# EAGLE design radio-v3.2 (EAGLE 9.6.1)
REVISION: 3.0; SCH_DESC: Dual ISM43340 5GHz radio transciever.; TEAM: RoboCup SSL
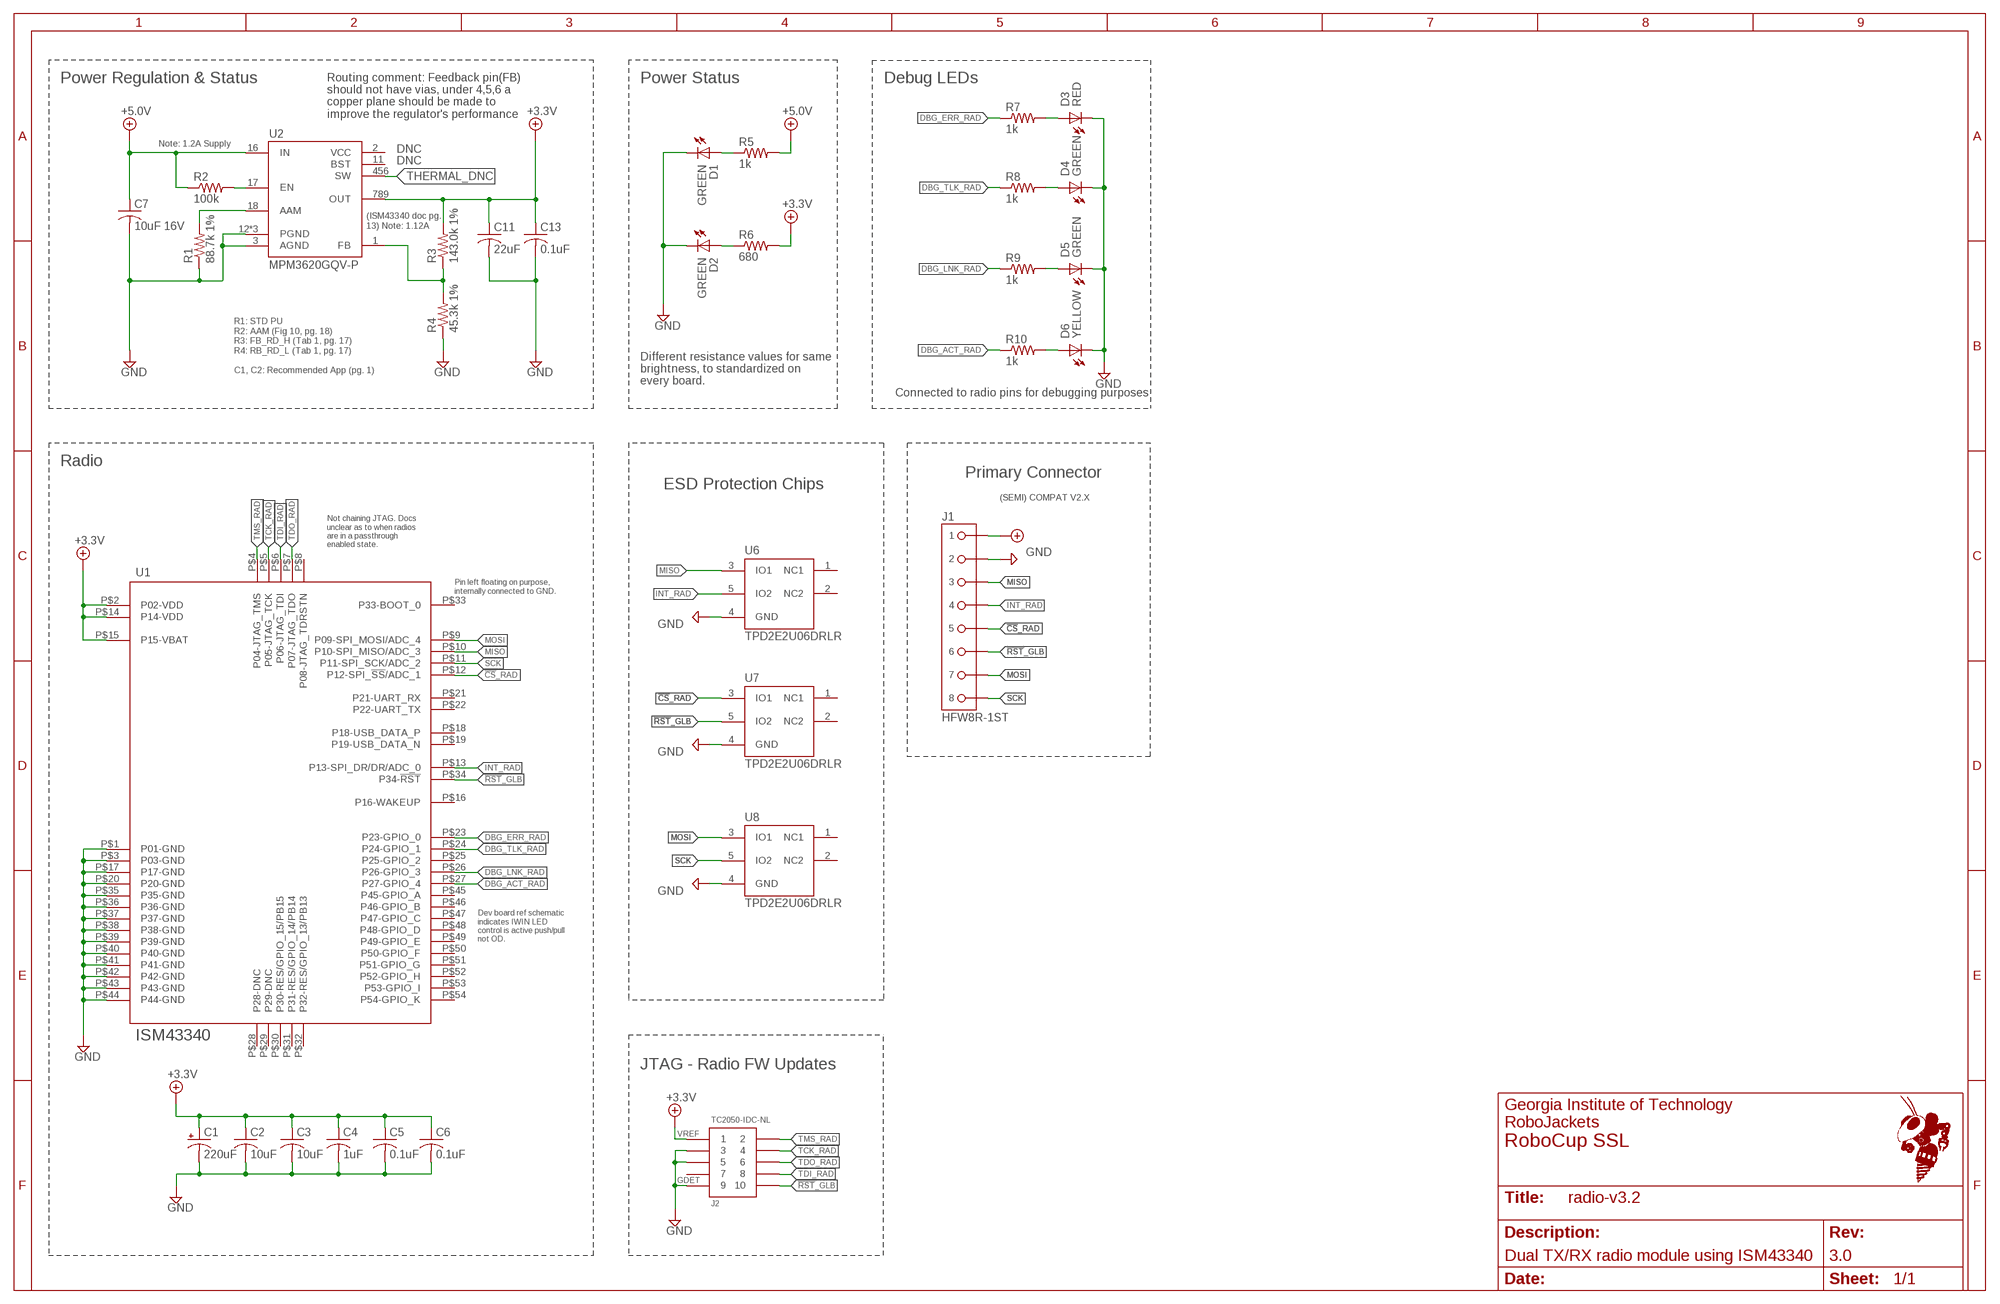
[diagram p0: schematic, sheet 1]
FRAME1 (FRAME_B_L): SCH_DESC: Dual TX/RX radio module using ISM43340

## Parts
C1  220uF  ECA-0JM221  [ECA-0JM221-HGT_HORIZ]
C2  10uF  C-USC0805  [C0805]
C3  10uF  C-USC0805  [C0805]
C4  1uF  C-USC0603  [C0603]
C5  0.1uF  C-USC0603  [C0603]
C6  0.1uF  C-USC0603  [C0603]
C7  10uF 16V  C-USC1210  [C1210]
C11  22uF  C-USC1210  [C1210]
C13  0.1uF  C-USC0603  [C0603]
D1  GREEN  LED-SMD-GREEN  [CHIP-LED0603]
D2  GREEN  LED-SMD-GREEN  [CHIP-LED0603]
D3  RED  LED-SMD-RED  [CHIP-LED0603]
D4  GREEN  LED-SMD-GREEN  [CHIP-LED0603]
D5  GREEN  LED-SMD-GREEN  [CHIP-LED0603]
D6  YELLOW  LED-SMD-YELLOW  [CHIP-LED0603]
J1  HFW8R-1ST  [HFW8R-1ST]
J2  TC2050-IDC-NL  [TC2050-IDC-NL]
R1  88.7k 1%  R-US_R0603  [R0603]
R2  100k  R-US_R0603  [R0603]
R3  143.0k 1%  R-US_R0603  [R0603]
R4  45.3k 1%  R-US_R0603  [R0603]
R5  1k  R-US_R0603  [R0603]
R6  680  R-US_R0603  [R0603]
R7  1k  R-US_R0603  [R0603]
R8  1k  R-US_R0603  [R0603]
R9  1k  R-US_R0603  [R0603]
R10  1k  R-US_R0603  [R0603]
U1  ISM43340  [ISM43340]
U2  MPM3620GQV-P  [MPM3620GQV-P]
U6  TPD2E2U06DRLR  [SOT-553]
U7  TPD2E2U06DRLR  [SOT-553]
U8  TPD2E2U06DRLR  [SOT-553]

## Nets
3V3_PWR_IND: D2.A R6.1
5V_PWR_IND: D1.A R5.1
!CS!_RAD: J1.5 U1.P$12(P12-SPI_!SS!/ADC_1) U7.3(IO1)
!RST!_GLB: J1.6 J2.P$10 U1.P$34(P34-!RST!) U7.5(IO2)
+3.3V: C1.P$1(+) C2.1 C3.1 C4.1 C5.1 C6.1 C11.1 C13.1 J2.P$1 R3.2 R6.2 U1.P$2(P02-VDD) U1.P$14(P14-VDD) U1.P$15(P15-VBAT) U2.789(OUT)
+5.0V: C7.1 J1.1 R2.1 R5.2 U2.16(IN)
AAM: R1.2 U2.18(AAM)
DBG_ACT_RAD: R10.1 U1.P$27(P27-GPIO_4)
DBG_ERR: D3.A R7.2
DBG_ERR_RAD: R7.1 U1.P$23(P23-GPIO_0)
DBG_LNK_RAD: R9.1 U1.P$26(P26-GPIO_3)
DBG_TLK_RAD: R8.1 U1.P$24(P24-GPIO_1)
DGB_ACT: D6.A R10.2
DGB_LNK: D5.A R9.2
EN: R2.2 U2.17(EN)
FB: R3.1 R4.2 U2.1(FB)
GND: C1.P$2(-) C2.2 C3.2 C4.2 C5.2 C6.2 C7.2 C11.2 C13.2 D1.C(K) D2.C(K) D3.C(K) D4.C(K) D5.C(K) D6.C(K) J1.2 J2.P$3 J2.P$5 J2.P$9 R1.1 R4.1 U1.P$1(P01-GND) U1.P$3(P03-GND) U1.P$17(P17-GND) U1.P$20(P20-GND) U1.P$35(P35-GND) U1.P$36(P36-GND) U1.P$37(P37-GND) U1.P$38(P38-GND) U1.P$39(P39-GND) U1.P$40(P40-GND) U1.P$41(P41-GND) U1.P$42(P42-GND) U1.P$43(P43-GND) U1.P$44(P44-GND) U2.3(AGND) U2.12(PGND) U2.13(PGND) U2.14(PGND) U6.4(GND) U7.4(GND) U8.4(GND)
INT_RAD: J1.4 U1.P$13(P13-SPI_DR/DR/ADC_0) U6.5(IO2)
MISO: J1.3 U1.P$10(P10-SPI_MISO/ADC_3) U6.3(IO1)
MOSI: J1.7 U1.P$9(P09-SPI_MOSI/ADC_4) U8.3(IO1)
SCK: J1.8 U1.P$11(P11-SPI_SCK/ADC_2) U8.5(IO2)
TCK_RAD: J2.P$4 U1.P$5(P05-JTAG_TCK)
TDI_RAD: J2.P$8 U1.P$6(P06-JTAG_TDI)
TDO_RAD: J2.P$6 U1.P$7(P07-JTAG_TDO)
THERMAL_DNC: U2.456(SW)
TLK: D4.A R8.2
TMS_RAD: J2.P$2 U1.P$4(P04-JTAG_TMS)
Unconnected: J1.LEG1 J1.LEG2 J2.P$7 U1.P$8(P08-JTAG_TDRSTN) U1.P$16(P16-WAKEUP) U1.P$18(P18-USB_DATA_P) U1.P$19(P19-USB_DATA_N) U1.P$21(P21-UART_RX) U1.P$22(P22-UART_TX) U1.P$25(P25-GPIO_2) U1.P$28(P28-DNC) U1.P$29(P29-DNC) U1.P$30(P30-RES/GPIO_15/PB15) U1.P$31(P31-RES/GPIO_14/PB14) U1.P$32(P32-RES/GPIO_13/PB13) U1.P$33(P33-BOOT_0) U1.P$45(P45-GPIO_A) U1.P$46(P46-GPIO_B) U1.P$47(P47-GPIO_C) U1.P$48(P48-GPIO_D) U1.P$49(P49-GPIO_E) U1.P$50(P50-GPIO_F) U1.P$51(P51-GPIO_G) U1.P$52(P52-GPIO_H) U1.P$53(P53-GPIO_I) U1.P$54(P54-GPIO_K) U2.2(VCC) U2.11(BST) U6.1(NC1) U6.2(NC2) U7.1(NC1) U7.2(NC2) U8.1(NC1) U8.2(NC2)

## Notes on the sheet
- Power Regulation & Status | Power Status | Debug LEDs
- Routing comment: Feedback pin(FB)
  should not have vias, under 4,5,6 a 
  copper plane should be made to 
  improve the regulator's performance
- Note: 1.2A Supply
- DNC
- DNC
- (ISM43340 doc pg. 
  13) Note: 1.12A
- R1: STD PU
  R2: AAM (Fig 10, pg. 18)
  R3: FB_RD_H (Tab 1, pg. 17)
  R4: RB_RD_L (Tab 1, pg. 17)
  
  C1, C2: Recommended App (pg. 1)
- Different resistance values for same
  brightness, to standardized on 
  every board.
- Connected to radio pins for debugging purposes
- Radio
- Primary Connector
- ESD Protection Chips
- (SEMI) COMPAT V2.X
- Not chaining JTAG. Docs 
  unclear as to when radios 
  are in a passthrough 
  enabled state.
- Pin left floating on purpose, 
  internally connected to GND.
- Dev board ref schematic 
  indicates IWIN LED 
  control is active push/pull 
  not OD.
- JTAG - Radio FW Updates
- VREF
- GDET

## Library data of the parts
C1 = RoboJackets-Capacitors:ECA-0JM221; DIGIKEY: P5572-ND; MANUFACTURER_PART_NUMBER: ECA-1HHG221
C2-C7 C11 C13 = rcl:C-US: CAPACITOR, American symbol; SPICEPREFIX: C
D1 D2 D4 D5 = RoboJackets-LEDs:LED-SMD; DIGIKEY: 160-1446-1-ND; MPN: LTST-C191KGKT
D3 = RoboJackets-LEDs:LED-SMD; DIGIKEY: 160-1447-1-ND; MPN: LTST-C191KRKT
D6 = RoboJackets-LEDs:LED-SMD; DIGIKEY: 160-1448-1-ND; MPN: LTST-C191KSKT
J1 = RoboJackets-Connectors:HFW8; DIGIKEY: 609-1788-1-ND; MPN: HFW8R-1STE1LF
J2 = RoboJackets-Connectors:TC2050-IDC-NL
R1-R10 = rcl:R-US_: RESISTOR, American symbol; SPICEPREFIX: R
U1 = RoboJackets-RF:ISM43340
U2 = mchair:MPM3620GQV-P
U6-U8 = radio_in_progress:TPD2E2U06DRLR

## Board
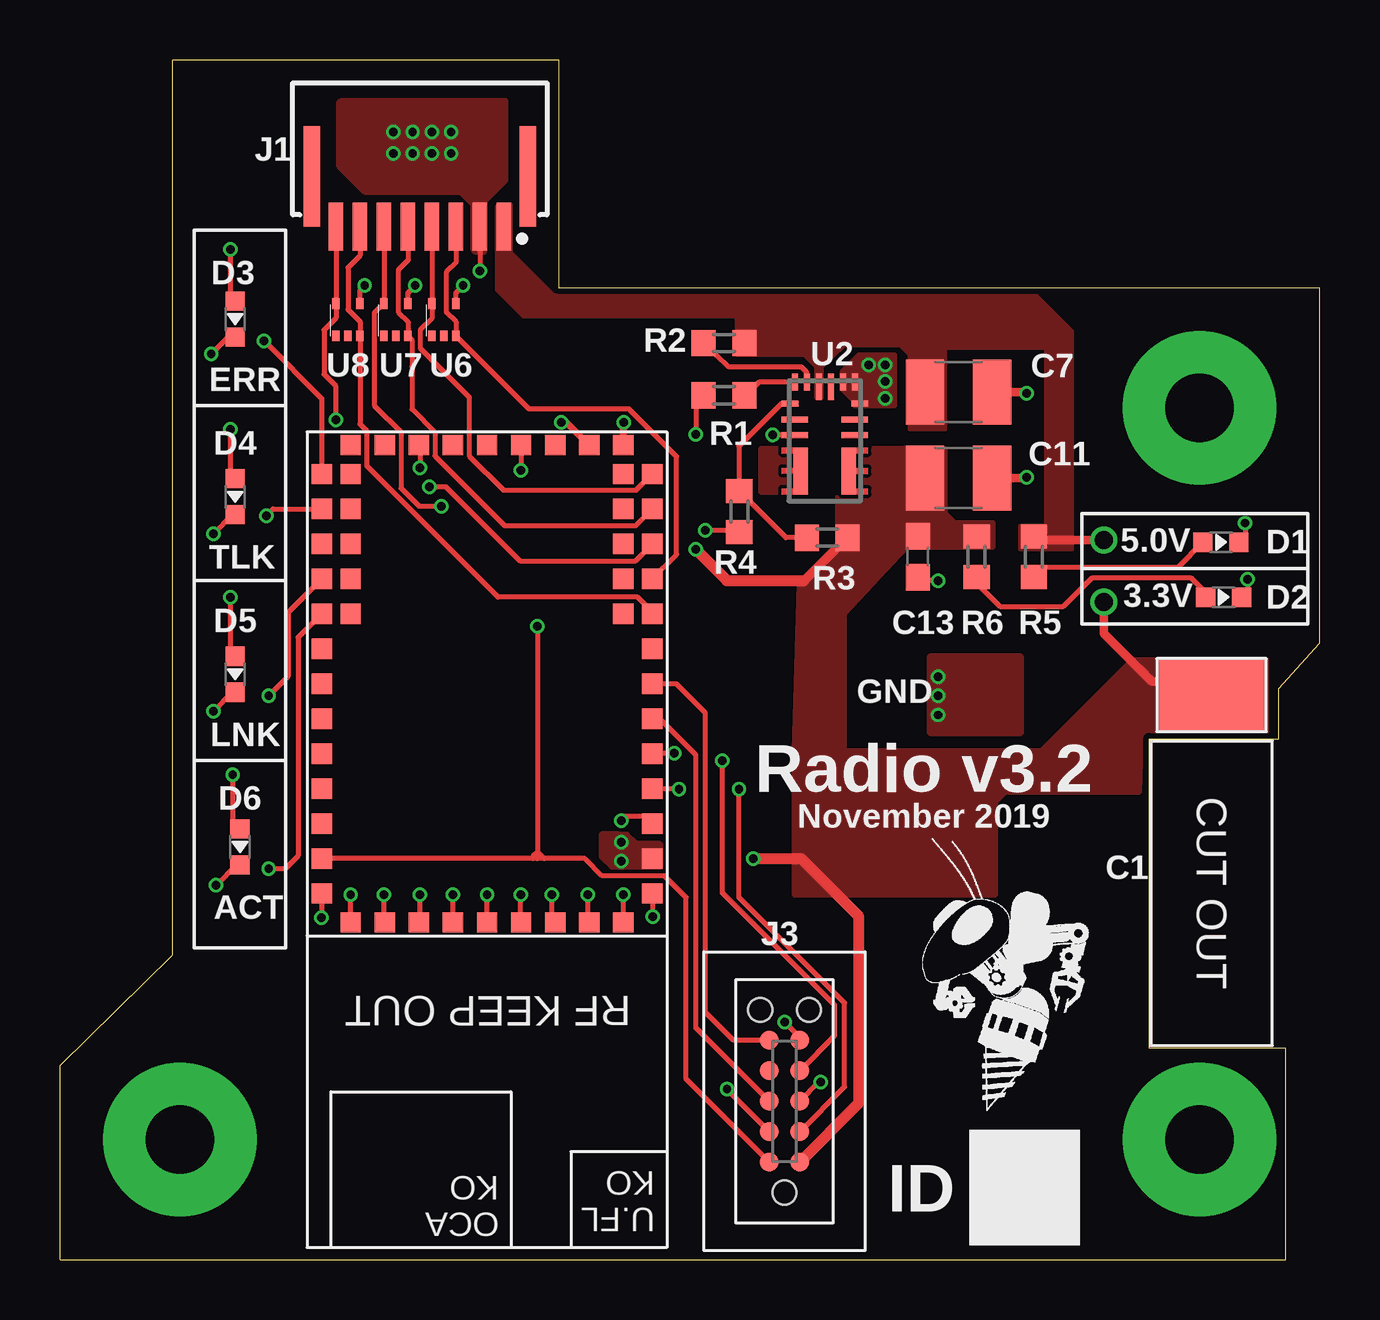
[diagram p1: board, top side]
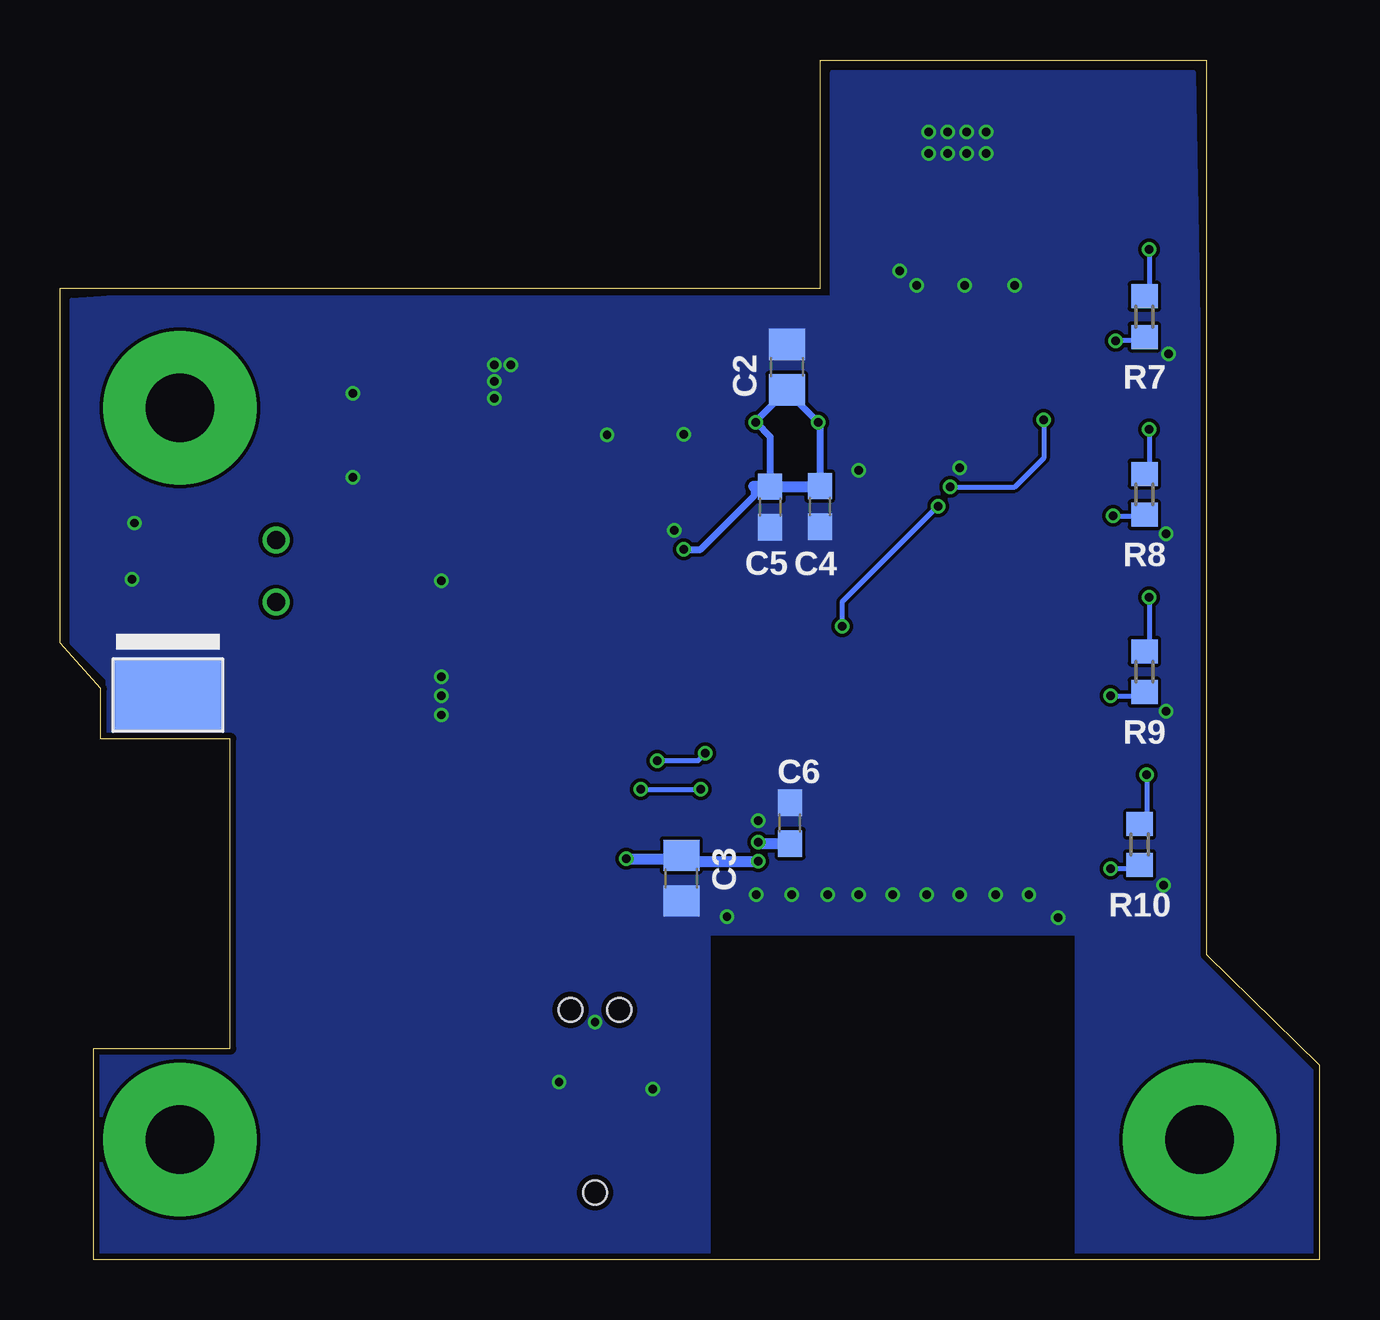
[diagram p2: board, bottom side, seen from below]

Size 52.5 x 50 mm. Coordinates in mm from the lower left corner, seen from the top.
Outline: 0,0 51.1,0 51.1,8.8 45.4,8.8 45.4,21.7 50.8,21.7 50.8,23.8 52.5,25.7 52.5,40.5 20.8,40.5 20.8,50 4.7,50 4.7,12.7 0,8.1 0,0
Copper layers (1*16): Top 0.018mm / dielectric 1.55mm / Bottom 0.018mm
Design rules "eC_2Layer_PClass6_BaseCopperO18_eCDefault": minimum track width 0.15mm, minimum drill 0.35mm, track to track 0.15mm, track to pad 0.15mm, pad to pad 0.15mm, via to via 0.15mm, smd to smd 0mil, copper to edge 0.25mm, drill to drill 0.35mm, minimum pad ring 0.175mm, minimum via ring 0.125mm, stop-mask expansion 0mil, vias tented up to drill 0.45mm, thermal gap 0.2mm

### Footprints (pad centres in the part's own frame; a part is rotated, then mirrored left to right if it is on the bottom)
ECA-0JM221-HGT_HORIZ = smd 4.5 x 3: P$1 0,1.905 | smd 4.5 x 3 bottom: P$2 0,1.905
C0805 = smd 1.3 x 1.5: 1 -0.95,0; 2 0.95,0
C0603 = smd 1.1 x 1: 1 -0.85,0; 2 0.85,0
C1210 = smd 1.6 x 2.7: 1 -1.4,0; 2 1.4,0
CHIP-LED0603 = smd 0.8 x 0.8: A 0,-0.75; C 0,0.75
HFW8R-1ST = smd 0.6 x 2: 1 -3.5,3.25; 2 -2.5,3.25; 3 -1.5,3.25; 4 -0.5,3.25; 5 0.5,3.25; 6 1.5,3.25; 7 2.5,3.25; 8 3.5,3.25 | smd 0.7 x 4.2: LEG1 -4.5,1.15; LEG2 4.5,1.15
TC2050-IDC-NL = smd 0.787 x 0.787: P$1 -2.54,-0.635; P$2 -1.27,-0.635; P$3 0,-0.635; P$4 1.27,-0.635; P$5 2.54,-0.635; P$6 2.54,0.635; P$7 1.27,0.635; P$8 0,0.635; P$9 -1.27,0.635; P$10 -2.54,0.635 | hole 0.991: -3.81,0; 3.81,1.015; 3.81,-1.015
R0603 = smd 1 x 1.1: 1 -0.85,0; 2 0.85,0
ISM43340 = smd 0.847 x 0.847: P$1 8.742,6.89; P$2 7.285,6.89; P$3 5.828,6.89; P$4 4.371,6.89; P$5 2.914,6.89; P$6 1.457,6.89; P$7 0,6.89; P$8 -1.457,6.89; P$9 -2.914,6.89; P$10 -4.371,6.89; P$11 -5.828,6.89; P$12 -7.285,6.89; P$13 -8.742,6.89; P$14 -9.948,5.684; P$15 -9.948,4.263; P$16 -9.948,2.842; P$17 -9.948,1.421; P$18 -9.948,0; P$19 -9.948,-1.421; P$20 -9.948,-2.842; P$21 -9.948,-4.263; P$22 -9.948,-5.684; P$23 -8.742,-6.89; P$24 -7.285,-6.89; P$25 -5.828,-6.89; P$26 -4.371,-6.89; P$27 -2.914,-6.89; P$28 -1.457,-6.89; P$29 0,-6.89; P$30 1.457,-6.89; P$31 2.914,-6.89; P$32 4.371,-6.89; P$33 5.828,-6.89; P$34 7.285,-6.89; P$35 8.742,-6.89; P$36 9.948,-5.684; P$37 9.948,-4.263; P$38 9.948,-2.842; P$39 9.948,-1.421; P$40 9.948,0; P$41 9.948,1.421; P$42 9.948,2.842; P$43 9.948,4.263; P$44 9.948,5.684; P$45 -8.742,-5.684; P$46 -7.285,-5.684; P$47 -5.828,-5.684; P$48 -4.371,-5.684; P$49 -2.914,-5.684; P$50 -8.742,5.684; P$51 -7.285,5.684; P$52 -5.828,5.684; P$53 -4.371,5.684; P$54 -2.914,5.684
MPM3620GQV-P = smd 0.7 x 0.25: 1 -1.45,1.55; 12 1.45,1.55 | smd 1.1 x 0.25: 2 -1.25,0.9; 3 -1.25,0.25; 10 1.25,0.25; 11 1.25,0.9 | smd 0.25 x 0.7: 13 1.25,2.45; 14 0.75,2.45; 17 -0.75,2.45; 18 -1.25,2.45 | smd 0.25 x 1.1: 15 0.25,2.25; 16 -0.25,2.25 | smd 0.6 x 1.95: 456 -1,-1.25; 789 1,-1.25
SOT-553 = smd 0.3 x 0.45: 1 -0.5,0; 2 0,0; 3 0.5,0; 4 0.5,1.35; 5 -0.5,1.35

### Placement (x,y rotation side)
C1  48,21.62 0 top
C2  22.2,37.2 90 bottom
C3  26.6,15.9 270 bottom
C4  20.83,31.39 270 bottom
C5  22.9,31.37 270 bottom
C6  22.07,18.19 90 bottom
C7  37.45,36.16 0 top
C11  37.45,32.57 0 top
C13  35.75,29.3 270 top
D1  48.39,29.9 270 top
D2  48.5,27.61 270 top
D3  7.3,39.2 180 top
D4  7.3,31.8 180 top
D5  7.3,24.4 180 top
D6  7.5,17.2 180 top
J1  15,46.3 180 top
J2  30.2,6.6 90 top
R1  27.68,36.02 0 top
R2  27.68,38.2 180 top
R3  31.98,30.09 0 top
R4  28.32,31.18 90 top
R5  40.59,29.3 90 top
R6  38.2,29.3 90 top
R7  7.3,39.3 90 bottom
R8  7.3,31.9 90 bottom
R9  7.3,24.5 90 bottom
R10  7.5,17.3 90 bottom
U1  17.8,24 270 top
U2  31.88,34.12 0 top
U6  16,38.5 0 top
U7  14,38.5 0 top
U8  12,38.5 0 top
U$1  [ROBOBUZZ_0.6X]  38.6,6.2 0 top

### Tracks (layer width: path | path; a pad name or v marks a point on that pad's centre or on a via)
3V3_PWR_IND
  Top 0.2: D2.A 47.75,27.8 47.15,28.4 43,28.4 41.8,27.2 39.2,27.2 38.34,28.05 38.34,28.11 38.2,28.25 R6.1
5V_PWR_IND
  Top 0.2: D1.A 46.59,28.84 40.99,28.84 R5.1
!CS!_RAD
  Top 0.2: J1.5 14.5,41.65 14.1,41.25 14.1,39.5 14.5,39.1 U7.3 14.67,38.33 14.67,37.23 14.67,35.44 15.63,34.48 15.63,33.49 18.54,30.59 24,30.59 U1.P$12
!RST!_GLB  (via drill 0.35)
  Top 0.2: J2.P$10 26.1,7.53 26.1,15.1 25.2,16 22.6,16 21.89,16.71 20.18,16.71 | 20.18,16.71 19.9,16.71 | 19.9,16.71 19.7,16.71 | 19.7,16.71 U1.P$34 | v19.9,26.4 19.9,17 | 19.9,17 19.9,16.71 | J1.6 U7.5 13.1,39.45 13.1,35.6 14.21,34.49 14.21,32.15 14.96,31.4 v15.9,31.4 | 19.9,17 19.7,16.8 19.7,16.71 | 19.9,17 20.18,16.71
  Bottom 0.2: v15.9,31.4 19.9,27.4 v19.9,26.4
+3.3V  (via drill 0.35, 0.75 pad 0.85)
  Top 0.2: U1.P$15 | v23.5,34.9 23.48,34.88
  Top 0.3: U1.P$15 21.1,34.9 v20.9,34.9 | U1.P$14 23.48,34.88 | 23.41,16.61 v23.4,16.6
  Top 0.35: v43.5,27.4 43.5,26.1 45.5,24.1 47.42,24.1 C1.P$1 | 31,28.3 31.04,28.3 R3.2
  Top 0.45: J2.P$1 33.3,6.53 33.3,14.3 30.9,16.7 v28.9,16.7 | v26.5,29.6 27.8,28.3 31,28.3
  Bottom 0.3: C4.1 20.83,34.83 v20.9,34.9 22.2,36.2 C2.1 23.5,34.95 v23.5,34.9 22.9,34.3 C5.1 | v26.5,29.6 25.8,29.6 23.58,31.82 23.58,32.22 | 26.75,16.7 C3.1 26.35,16.6 | v23.4,17.4 23.34,17.34
  Bottom 0.45: 23.58,32.22 C5.1 20.85,32.22 C4.1 | v28.9,16.7 26.75,16.7 | 26.35,16.6 v23.4,16.6 | 23.34,17.34 C6.1
  pour Top (no thermals): 30.8,28.2 30.6,21.2 30.8,21.2 32.7,21.2 32.7,26.9 35.3,29.7 38.9,29.7 38.9,30.7 37.3,30.7 36.9,31.1 36.9,33.8 32.4,33.8 32.4,29.8
  pour Top (no thermals): 30.6,21.2 30.6,15.2 39,15.2 39,19.1 39.4,19.5 45,19.5 45.1,22 50.3,22 50.3,25 44.7,25 40.9,21.2
  pour Top (no thermals): 25,17.3 24,17.3 23.6,17.7 22.6,17.7 22.6,16.8 23,16.4 25,16.4
+5.0V  (via drill 0.75 pad 0.85)
  Top 0.3: 40.74,30 R5.2
  Top 0.35: v43.5,30 40.74,30
  pour Top (rank 5, no thermals): 28.2,39.3 28.2,37.7 31,37.7 31.5,37.2 31.5,35.9 31.75,35.9 31.75,37.2 32.7,38.1 35,38.1 35.4,37.7 35.4,34.6 36.9,34.6 36.9,38 41.1,38 41.1,30.6 40,30.6 40,29.6 42.2,29.6 42.2,38.7 40.7,40.2 20.6,40.2 18.8,42 18.8,44 18.3,44 18.2,43.9 18.2,40.4 19.3,39.3
AAM
  Top 0.2: U2.18 29.13,36.57 28.58,36.02 R1.2
BOLT1  (via drill 2.85 pad 6.4)
  other vias: 47.5,35.5
BOLT2  (via drill 2.85 pad 6.4)
  other vias: 47.5,5
BOLT3  (via drill 2.85 pad 6.4)
  other vias: 5,5
DBG_ACT_RAD  (via drill 0.35)
  Top 0.2: v8.7,16.3 9.4,16.3 9.93,16.83 9.93,25.93 U1.P$27
  Bottom 0.2: R10.1 7.65,16.3 v8.7,16.3
DBG_ERR  (via drill 0.35)
  Top 0.2: v7.1,42.1 7.1,40.15 D3.A
  Bottom 0.2: R7.2 7.1,40.35 v7.1,42.1
DBG_ERR_RAD  (via drill 0.35)
  Top 0.2: v8.5,38.3 10.91,35.89 U1.P$23
  Bottom 0.2: R7.1 7.45,38.3 v8.5,38.3
DBG_LNK_RAD  (via drill 0.35)
  Top 0.2: v8.7,23.5 9.5,24.3 9.5,26.96 U1.P$26
  Bottom 0.2: v8.7,23.5 7.45,23.5 R9.1
DBG_TLK_RAD  (via drill 0.35)
  Top 0.2: v8.6,31 8.88,31.29 U1.P$24
  Bottom 0.2: R8.1 7.35,31 v8.6,31
DGB_ACT  (via drill 0.35)
  Top 0.2: D6.A 7.2,18.25 v7.2,20.2
  Bottom 0.2: R10.2 7.2,18.45 v7.2,20.2
DGB_LNK  (via drill 0.35)
  Top 0.2: v7.1,27.6 7.1,25.35 D5.A
  Bottom 0.2: v7.1,27.6 7.1,25.55 R9.2
EN
  Top 0.2: U2.17 31.13,36.97 30.9,37.2 27.87,37.2 R2.2
FB
  Top 0.2: U2.1 30.07,35.67 28.3,33.9 28.3,32.05 R4.2 30.26,30.09 R3.1
GND  (via drill 0.35)
  Top 0.2: J2.P$9 v27.8,7.09 v27.8,7.1 | J2.P$3 31.64,7.4 v31.7,7.4 | v23.4,18.3 23.57,18.47 24.39,18.47 U1.P$3 | U1.P$42 20.5,14.19 v20.5,15.2 | U1.P$40 v17.8,15.2 | U1.P$38 15,14.05 v15,15.2 | U1.P$37 13.5,14.09 v13.5,15.2 | v36.6,28.3 35.9,28.3 C13.2 | U1.P$20 15,33.91 v15,33 | U1.P$17 19.22,32.92 v19.2,32.9 | R1.1 26.5,35.69 v26.5,34.4 | v40.3,32.6 40.27,32.57 | v40.3,36.1 40.24,36.16 | U8.4 12.5,40.4 v12.7,40.6 | U7.4 14.5,40.3 v14.8,40.6 | U6.4 16.5,40.3 v16.8,40.6 | J1.2 v17.5,41.2 | v49.5,28.35 49.5,27.86 D2.C | D1.C 49.4,30.16 v49.4,30.7 | J2.P$5 30.84,9.27 v30.2,9.9 | U1.P$43 22,14.11 v22,15.2 | U1.P$41 19.2,14.07 v19.2,15.2 | U1.P$39 v16.38,15.2 | v26.9,30.4 28.25,30.4 R4.1 | U2.3 v29.7,34.37 | U1.P$35 10.9,15.25 v10.9,14.26 | U1.P$1 24.7,15.25 v24.7,14.3 | U1.P$36 v12.12,15.2 | U1.P$44 v23.48,15.2 | v6.5,15.6 7.35,16.45 D6.C | v6.4,22.85 7.2,23.65 D5.C | v6.4,30.25 7.2,31.05 D4.C | v6.3,37.75 7,38.45 D3.C
  Top 0.35: 40.27,32.57 C11.2 | 40.24,36.16 C7.2
  other vias: 33.7,37.3 34.4,37.3 34.4,36.6 34.4,35.9 36.6,22.7 36.6,23.5 36.6,24.3 13.9,46.1 13.9,47 14.7,46.1 14.7,47 15.5,47 15.5,46.1 16.3,47 16.3,46.1
  pour Bottom (no thermals): 25.5,13.6 25.5,0.2 50.9,0.3 50.9,8.6 45.1,8.6 45.1,21.9 50.5,21.9 50.5,24.2 52,25.7 52,40 50.5,40.1 20.3,40.1 20.3,49.5 5.27,49.5 5,34.5 5,12.5 0.3,7.8 0.3,0.3 10.1,0.3 10.1,13.6
  pour Top (no thermals): 34.8,37.7 33.3,37.7 32.6,37 32.6,36.3 33.1,35.8 33.1,35.6 34.8,35.6
  pour Top (no thermals): 36.3,25.1 36.3,22 40,22 40,25.1
  pour Top (no thermals): 17.2,44 17.2,42.1 17.3,42 17.7,42 17.7,44.1 18.6,45 18.6,48.3 11.7,48.3 11.6,48.2 11.6,45.6 12.7,44.5 16.7,44.5
INT_RAD
  Top 0.2: J1.4 U6.5 15.5,39.23 15.02,38.75 15.02,37.98 17.05,35.95 17.05,33.49 18.48,32.07 24.01,32.07 U1.P$13
MISO
  Top 0.2: U1.P$10 25.7,29.39 25.7,33.48 23.73,35.45 19.55,35.45 U6.3 16.5,39.1 16.1,39.5 16.1,41.15 16.5,41.55 J1.3
MOSI
  Top 0.2: U1.P$9 24.77,26.91 24.07,27.61 18.25,27.61 12.8,33.07 12.8,34.53 12.5,34.83 U8.3 12.5,39.1 12,39.6 12,41.35 12.5,41.85 J1.7
SCK  (via drill 0.35)
  Top 0.2: U1.P$11 23.96,29.1 19.2,29.1 16.1,32.2 v15.4,32.2 | J1.8 U8.5 11.5,39.25 11,38.75 11,36.9 11.5,36.4 v11.5,35
  Bottom 0.2: v15.4,32.2 12.7,32.2 11.5,33.4 v11.5,35
TCK_RAD  (via drill 0.35)
  Top 0.2: J2.P$4 32.3,9.34 32.3,10.6 27.6,15.3 v27.6,20.8 | v25.6,21.1 25.59,21.09 U1.P$5
  Bottom 0.2: v27.6,20.8 25.9,20.8 v25.6,21.1
TDI_RAD
  Top 0.2: U1.P$6 24.99,22.54 26.49,21.04 26.49,9.68 J2.P$8
TDO_RAD
  Top 0.2: J2.P$6 28.07,9.14 26.89,10.31 26.89,22.8 25.69,24 U1.P$7
THERMAL_DNC
  pour Top (no thermals): 31.1,33.8 29.2,33.8 29.2,32 31.1,32
TLK  (via drill 0.35)
  Top 0.2: v7.1,34.6 7.1,32.75 D4.A
  Bottom 0.2: v7.1,34.6 7.1,32.95 R8.2
TMS_RAD  (via drill 0.35)
  Top 0.2: U1.P$4 25.77,19.63 v25.8,19.6 | J2.P$2 32.7,7.2 32.7,10.7 28.3,15.1 v28.3,19.6
  Bottom 0.2: v28.3,19.6 v25.8,19.6

### Text on the board
tPlace: ERR | 5.0V | TLK | 3.3V | LNK | Radio v3.2 | ACT | J3 | ID
tNames: GND | November 2019